# Altium schematic sheet CATS-Vega-RF.SchDoc: CATS Vega
size A4; Author: Luca Jost; Revision: V1.0; SheetNumber: 13; SheetTotal: 16; Subtitle: RF
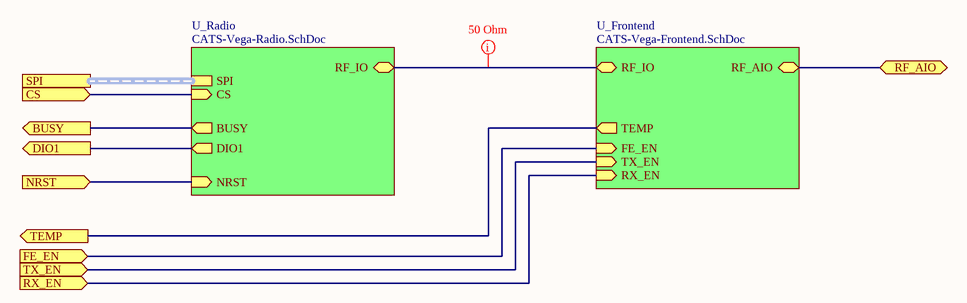
[diagram p0: CATS-Vega-RF.SchDoc]

## Sub-sheets
U_Frontend = CATS-Vega-Frontend.SchDoc: FE_EN (in), TX_EN (in), TEMP (out), RF_IO (bidir), RX_EN (in), RF_AIO (bidir)
U_Radio = CATS-Vega-Radio.SchDoc: SPI (harness SPI), CS (in), BUSY (out), DIO1 (out), RF_IO (bidir), NRST (in)

## Ports
BUSY (out), CS (in), DIO1 (out), FE_EN (in), NRST (in), RF_AIO (bidir), RX_EN (in), SPI (harness SPI), TEMP (out), TX_EN (in)

## Nets
BUSY: port BUSY, sheet U_Radio/BUSY
CS: port CS, sheet U_Radio/CS
DIO1: port DIO1, sheet U_Radio/DIO1
FE_EN: port FE_EN, sheet U_Frontend/FE_EN
NRST: port NRST, sheet U_Radio/NRST
RF_AIO: port RF_AIO, sheet U_Frontend/RF_AIO
RX_EN: port RX_EN, sheet U_Frontend/RX_EN
TEMP: port TEMP, sheet U_Frontend/TEMP
TX_EN: port TX_EN, sheet U_Frontend/TX_EN
(unnamed): sheet U_Frontend/RF_IO, sheet U_Radio/RF_IO

## Buses and harness runs
harness port SPI = sheet U_Radio/SPI

## Layout directives
rule Impedance Constraint [Min = 50.00    Max = 50.00    ]: (no net found under the mark)

## Notes on the sheet
- Title
- Author:
- Subtitle
- Date:
- Rev:
- File:
- Sheet
- of